# Altium schematic sheet NEB_LED_KEY.SchDoc
size A4; Organization: Altium Limited; Address1: L3, 12a Rodborough Rd; Address2: Frenchs Forest; Address3: NSW; Address4: Australia 2086; DocumentNumber: 3; SheetNumber: 3; SheetTotal: 10
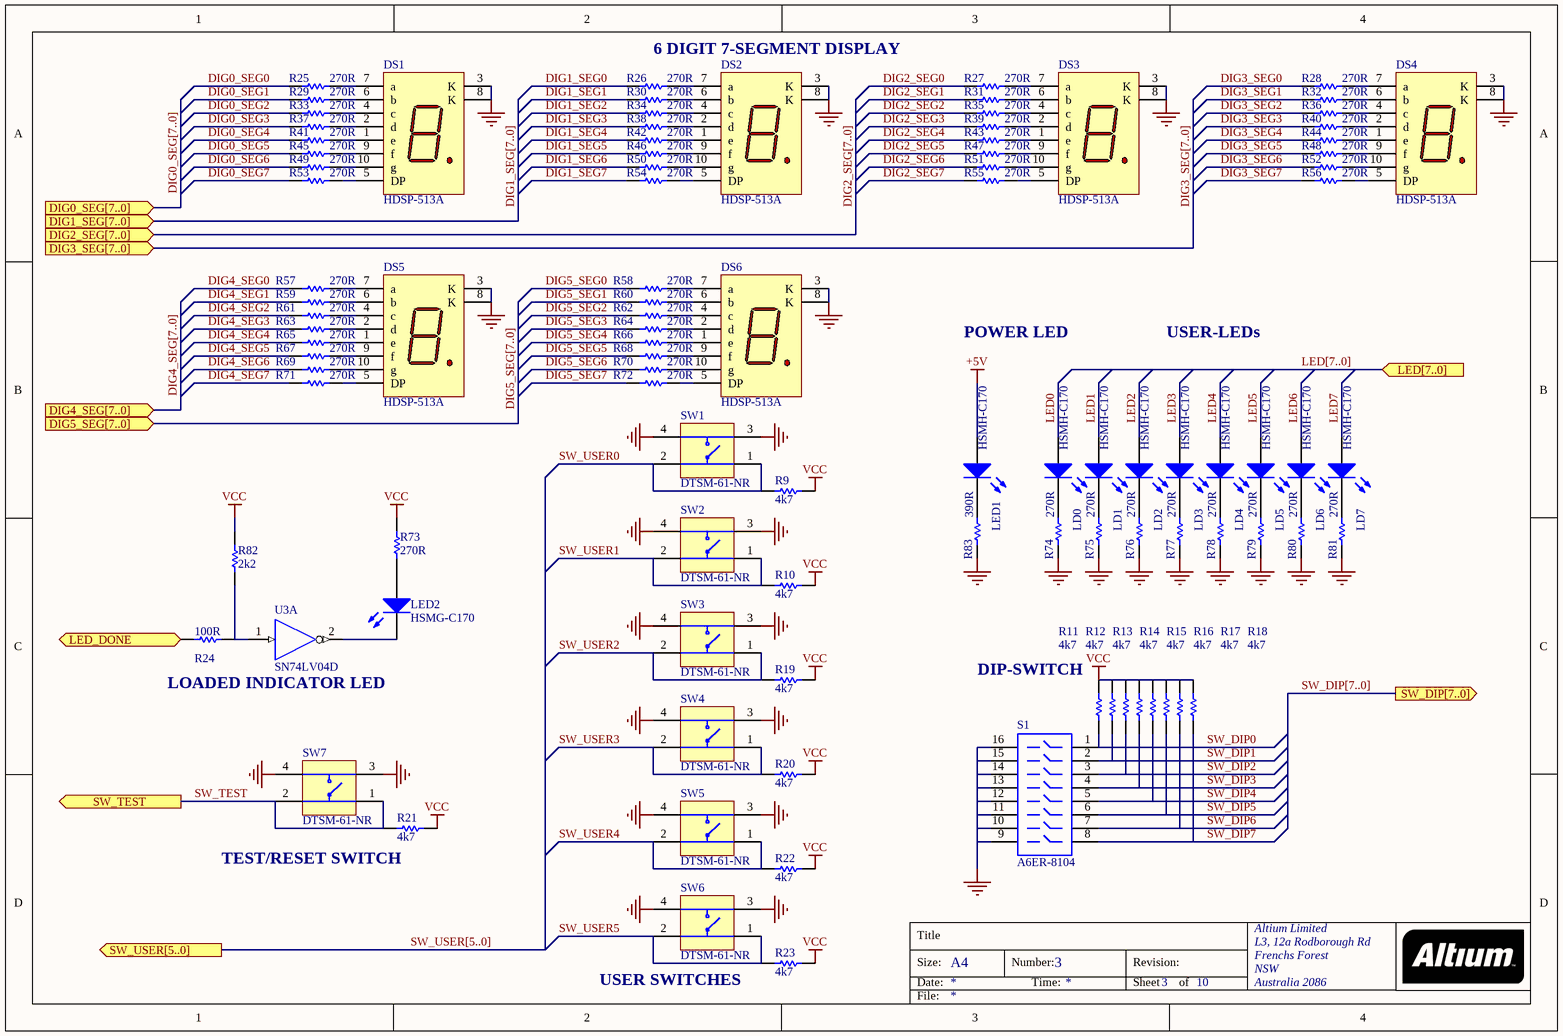
[diagram p0: NEB_LED_KEY.SchDoc]

## Parts
DS1  HDSP-513A  [SA/SC56]
DS2  HDSP-513A  [SA/SC56]
DS3  HDSP-513A  [SA/SC56]
DS4  HDSP-513A  [SA/SC56]
DS5  HDSP-513A  [SA/SC56]
DS6  HDSP-513A  [SA/SC56]
LD0  HSMH-C170  [SMD _LED]
LD1  HSMH-C170  [SMD _LED]
LD2  HSMH-C170  [SMD _LED]
LD3  HSMH-C170  [SMD _LED]
LD4  HSMH-C170  [SMD _LED]
LD5  HSMH-C170  [SMD _LED]
LD6  HSMH-C170  [SMD _LED]
LD7  HSMH-C170  [SMD _LED]
LED1  HSMH-C170  [SMD _LED]
LED2  HSMG-C170  [SMD _LED]
R9  4k7  [CR2012-0805]
R10  4k7  [CR2012-0805]
R11  4k7  [CR2012-0805]
R12  4k7  [CR2012-0805]
R13  4k7  [CR2012-0805]
R14  4k7  [CR2012-0805]
R15  4k7  [CR2012-0805]
R16  4k7  [CR2012-0805]
R17  4k7  [CR2012-0805]
R18  4k7  [CR2012-0805]
R19  4k7  [CR2012-0805]
R20  4k7  [CR2012-0805]
R21  4k7  [CR2012-0805]
R22  4k7  [CR2012-0805]
R23  4k7  [CR2012-0805]
R24  100R  [CR2012-0805]
R25  270R  [CR2012-0805]
R26  270R  [CR2012-0805]
R27  270R  [CR2012-0805]
R28  270R  [CR2012-0805]
R29  270R  [CR2012-0805]
R30  270R  [CR2012-0805]
R31  270R  [CR2012-0805]
R32  270R  [CR2012-0805]
R33  270R  [CR2012-0805]
R34  270R  [CR2012-0805]
R35  270R  [CR2012-0805]
R36  270R  [CR2012-0805]
R37  270R  [CR2012-0805]
R38  270R  [CR2012-0805]
R39  270R  [CR2012-0805]
R40  270R  [CR2012-0805]
R41  270R  [CR2012-0805]
R42  270R  [CR2012-0805]
R43  270R  [CR2012-0805]
R44  270R  [CR2012-0805]
R45  270R  [CR2012-0805]
R46  270R  [CR2012-0805]
R47  270R  [CR2012-0805]
R48  270R  [CR2012-0805]
R49  270R  [CR2012-0805]
R50  270R  [CR2012-0805]
R51  270R  [CR2012-0805]
R52  270R  [CR2012-0805]
R53  270R  [CR2012-0805]
R54  270R  [CR2012-0805]
R55  270R  [CR2012-0805]
R56  270R  [CR2012-0805]
R57  270R  [CR2012-0805]
R58  270R  [CR2012-0805]
R59  270R  [CR2012-0805]
R60  270R  [CR2012-0805]
R61  270R  [CR2012-0805]
R62  270R  [CR2012-0805]
R63  270R  [CR2012-0805]
R64  270R  [CR2012-0805]
R65  270R  [CR2012-0805]
R66  270R  [CR2012-0805]
R67  270R  [CR2012-0805]
R68  270R  [CR2012-0805]
R69  270R  [CR2012-0805]
R70  270R  [CR2012-0805]
R71  270R  [CR2012-0805]
R72  270R  [CR2012-0805]
R73  270R  [CR2012-0805]
R74  270R  [CR2012-0805]
R75  270R  [CR2012-0805]
R76  270R  [CR2012-0805]
R77  270R  [CR2012-0805]
R78  270R  [CR2012-0805]
R79  270R  [CR2012-0805]
R80  270R  [CR2012-0805]
R81  270R  [CR2012-0805]
R82  2k2  [CR2012-0805]
R83  390R  [CR2012-0805]
S1  A6ER-8104  [DIP-16-KEY]
SW1  DTSM-61-NR  [B3FS_SWITCH]
SW2  DTSM-61-NR  [B3FS_SWITCH]
SW3  DTSM-61-NR  [B3FS_SWITCH]
SW4  DTSM-61-NR  [B3FS_SWITCH]
SW5  DTSM-61-NR  [B3FS_SWITCH]
SW6  DTSM-61-NR  [B3FS_SWITCH]
SW7  DTSM-61-NR  [B3FS_SWITCH]
U3  SN74LV04D  [D014]  (part A of 6)

## Ports
DIG0_SEG[7..0] (in), DIG1_SEG[7..0] (in), DIG2_SEG[7..0] (in), DIG3_SEG[7..0] (in), DIG4_SEG[7..0] (in), DIG5_SEG[7..0] (in), LED[7..0] (in), LED_DONE (in), SW_DIP[7..0] (out), SW_TEST (out), SW_USER[5..0] (out)

## Nets
+5V: LED1.1(A)
GND: DS1.3(K) DS1.8(K) DS2.3(K) DS2.8(K) DS3.3(K) DS3.8(K) DS4.3(K) DS4.8(K) DS5.3(K) DS5.8(K) DS6.3(K) DS6.8(K) R74.1 R75.1 R76.1 R77.1 R78.1 R79.1 R80.1 R81.1 R83.1 S1.9 S1.10 S1.11 S1.12 S1.13 S1.14 S1.15 S1.16 SW1.3 SW1.4 SW2.3 SW2.4 SW3.3 SW3.4 SW4.3 SW4.4 SW5.3 SW5.4 SW6.3 SW6.4 SW7.3 SW7.4 U3.7(GND)
VCC: R9.1 R10.1 R11.2 R12.2 R13.2 R14.2 R15.2 R16.2 R17.2 R18.2 R19.1 R20.1 R21.1 R22.1 R23.1 R73.2 R82.1 U3.14(VCC)
DIG0_SEG0: R25.2
DIG0_SEG1: R29.2
DIG0_SEG2: R33.2
DIG0_SEG3: R37.2
DIG0_SEG4: R41.2
DIG0_SEG5: R45.2
DIG0_SEG6: R49.2
DIG0_SEG7: R53.2
DIG1_SEG0: R26.2
DIG1_SEG1: R30.2
DIG1_SEG2: R34.2
DIG1_SEG3: R38.2
DIG1_SEG4: R42.2
DIG1_SEG5: R46.2
DIG1_SEG6: R50.2
DIG1_SEG7: R54.2
DIG2_SEG0: R27.2
DIG2_SEG1: R31.2
DIG2_SEG2: R35.2
DIG2_SEG3: R39.2
DIG2_SEG4: R43.2
DIG2_SEG5: R47.2
DIG2_SEG6: R51.2
DIG2_SEG7: R55.2
DIG3_SEG0: R28.2
DIG3_SEG1: R32.2
DIG3_SEG2: R36.2
DIG3_SEG3: R40.2
DIG3_SEG4: R44.2
DIG3_SEG5: R48.2
DIG3_SEG6: R52.2
DIG3_SEG7: R56.2
DIG4_SEG0: R57.2
DIG4_SEG1: R59.2
DIG4_SEG2: R61.2
DIG4_SEG3: R63.2
DIG4_SEG4: R65.2
DIG4_SEG5: R67.2
DIG4_SEG6: R69.2
DIG4_SEG7: R71.2
DIG5_SEG0: R58.2
DIG5_SEG1: R60.2
DIG5_SEG2: R62.2
DIG5_SEG3: R64.2
DIG5_SEG4: R66.2
DIG5_SEG5: R68.2
DIG5_SEG6: R70.2
DIG5_SEG7: R72.2
LED0: LD0.1(A)
LED1: LD1.1(A)
LED2: LD2.1(A)
LED3: LD3.1(A)
LED4: LD4.1(A)
LED5: LD5.1(A)
LED6: LD6.1(A)
LED7: LD7.1(A)
LED_DONE: R24.1 ; port LED_DONE
SW_DIP0: R11.1 S1.1
SW_DIP1: R12.1 S1.2
SW_DIP2: R13.1 S1.3
SW_DIP3: R14.1 S1.4
SW_DIP4: R15.1 S1.5
SW_DIP5: R16.1 S1.6
SW_DIP6: R17.1 S1.7
SW_DIP7: R18.1 S1.8
SW_TEST: R21.2 SW7.1 SW7.2 ; port SW_TEST
SW_USER0: R9.2 SW1.1 SW1.2
SW_USER1: R10.2 SW2.1 SW2.2
SW_USER2: R19.2 SW3.1 SW3.2
SW_USER3: R20.2 SW4.1 SW4.2
SW_USER4: R22.2 SW5.1 SW5.2
SW_USER5: R23.2 SW6.1 SW6.2
NetDS1_1: DS1.1(e) R41.1
NetDS1_2: DS1.2(d) R37.1
NetDS1_4: DS1.4(c) R33.1
NetDS1_5: DS1.5(DP) R53.1
NetDS1_6: DS1.6(b) R29.1
NetDS1_7: DS1.7(a) R25.1
NetDS1_9: DS1.9(f) R45.1
NetDS1_10: DS1.10(g) R49.1
NetDS2_1: DS2.1(e) R42.1
NetDS2_2: DS2.2(d) R38.1
NetDS2_4: DS2.4(c) R34.1
NetDS2_5: DS2.5(DP) R54.1
NetDS2_6: DS2.6(b) R30.1
NetDS2_7: DS2.7(a) R26.1
NetDS2_9: DS2.9(f) R46.1
NetDS2_10: DS2.10(g) R50.1
NetDS3_1: DS3.1(e) R43.1
NetDS3_2: DS3.2(d) R39.1
NetDS3_4: DS3.4(c) R35.1
NetDS3_5: DS3.5(DP) R55.1
NetDS3_6: DS3.6(b) R31.1
NetDS3_7: DS3.7(a) R27.1
NetDS3_9: DS3.9(f) R47.1
NetDS3_10: DS3.10(g) R51.1
NetDS4_1: DS4.1(e) R44.1
NetDS4_2: DS4.2(d) R40.1
NetDS4_4: DS4.4(c) R36.1
NetDS4_5: DS4.5(DP) R56.1
NetDS4_6: DS4.6(b) R32.1
NetDS4_7: DS4.7(a) R28.1
NetDS4_9: DS4.9(f) R48.1
NetDS4_10: DS4.10(g) R52.1
NetDS5_1: DS5.1(e) R65.1
NetDS5_2: DS5.2(d) R63.1
NetDS5_4: DS5.4(c) R61.1
NetDS5_5: DS5.5(DP) R71.1
NetDS5_6: DS5.6(b) R59.1
NetDS5_7: DS5.7(a) R57.1
NetDS5_9: DS5.9(f) R67.1
NetDS5_10: DS5.10(g) R69.1
NetDS6_1: DS6.1(e) R66.1
NetDS6_2: DS6.2(d) R64.1
NetDS6_4: DS6.4(c) R62.1
NetDS6_5: DS6.5(DP) R72.1
NetDS6_6: DS6.6(b) R60.1
NetDS6_7: DS6.7(a) R58.1
NetDS6_9: DS6.9(f) R68.1
NetDS6_10: DS6.10(g) R70.1
NetLD0_2: LD0.2(K) R74.2
NetLD1_2: LD1.2(K) R75.2
NetLD2_2: LD2.2(K) R76.2
NetLD3_2: LD3.2(K) R77.2
NetLD4_2: LD4.2(K) R78.2
NetLD5_2: LD5.2(K) R79.2
NetLD6_2: LD6.2(K) R80.2
NetLD7_2: LD7.2(K) R81.2
NetLED1_2: LED1.2(K) R83.2
NetLED2_1: LED2.1(A) R73.1
NetLED2_2: LED2.2(K) U3.2(Y)
NetR24_2: R24.2 R82.2 U3.1(A)

## Buses and harness runs
bus DIG0_SEG[7..0] = port DIG0_SEG[7..0]
bus DIG1_SEG[7..0] = port DIG1_SEG[7..0]
bus DIG2_SEG[7..0] = port DIG2_SEG[7..0]
bus DIG3_SEG[7..0] = port DIG3_SEG[7..0]
bus DIG4_SEG[7..0] = port DIG4_SEG[7..0]
bus DIG5_SEG[7..0] = port DIG5_SEG[7..0]
bus LED[7..0] = port LED[7..0]
bus SW_DIP[7..0] = port SW_DIP[7..0]
bus SW_USER[5..0] = port SW_USER[5..0]

## Notes on the sheet
- 6 DIGIT 7-SEGMENT DISPLAY
- POWER LED
- USER-LEDs
- LOADED INDICATOR LED
- DIP-SWITCH
- TEST/RESET SWITCH
- (near SW6) USER SWITCHES
- Title
- Size:
- Date:
- A4
- Number:
- Time:
- Revision:
- Sheet
- of
- File:

## Library data of the parts
DS1-DS6 = HDSP-513A: 14.2 mm General Purpose 7-Segment Display: CC, RH DP; Package Information: Latest Revision: 25-Jul-2001; Min. Intensity: 3201 ucd; Note: IF = 10 mA; Colour: AlGaAs Red; Published: 26-May-2004; Datasheet: Latest Revision: 25-Jul-2001; Package Reference: HDSP-5; Publisher: Altium Limited
LD0-LD7 LED1 = HSMX-C670: Typical RED GaAs SMD LED Agilent make; Manufacturer: Generic Components; Class I: Optoelectronic; Fitted: True; Published: 8-Jun-2000; Revision: July-2002: Re-released for DXP Platform.; Publisher: Altium Limited; Class II: LED
LED2 = HSMX-C670: Typical GREEN GaAs SMD LED Agilent make; Manufacturer: Generic Components; Class I: Optoelectronic; Fitted: True; Published: 8-Jun-2000; Revision: July-2002: Re-released for DXP Platform.; Publisher: Altium Limited; Class II: LED
R9-R23 R25-R72 R74-R81 R83 = RES: Resistor; Fitted: True
R24 R73 R82 = RES: Resistor
S1 = A6ER-8104: DIP Switch Side actuator long liver Piano Key; Manufacturer: Generic Components; Fitted: True; Published: 24-Mar-1999; Revision: July-2002: Re-released for DXP Platform.; Publisher: Altium Limited
SW1-SW7 = B3FS: SPNA SMD Keyboard Switch; Fitted: True
U3 = SN74LV04D: Hex Inverter; Package Information: Latest Revision: Jan-1998; Published: 8-Jun-2000; Revision: 17-Jul-2002: Re-released for DXP Platform.; Datasheet: Latest Revision: Apr-1996; Package Reference: D014; Publisher: Altium Limited